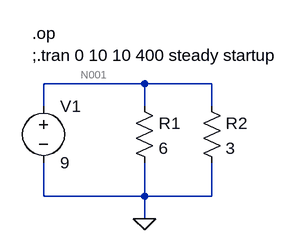
[diagram p0: schematic Draft5.asc]
Draft5.asc, the LTspice schematic file:
Version 4.1
SHEET 1 880 680
WIRE 192 16 48 16
WIRE 288 16 192 16
WIRE 48 48 48 16
WIRE 192 48 192 16
WIRE 288 48 288 16
WIRE 48 176 48 128
WIRE 192 176 192 128
WIRE 192 176 48 176
WIRE 288 176 288 128
WIRE 288 176 192 176
WIRE 192 208 192 176
FLAG 192 208 0
SYMBOL voltage 48 32 R0
SYMATTR InstName V1
SYMATTR Value 9
SYMBOL res 176 32 R0
SYMATTR InstName R1
SYMATTR Value 6
SYMBOL res 272 32 R0
SYMATTR InstName R2
SYMATTR Value 3
TEXT 32 -56 Left 2 !.op\n;.tran 0 10 10 400 steady startup

The netlist it stands for:
* Draft5.asc
V1 N001 0 9
R1 N001 0 6
R2 N001 0 3
.op
;.tran 0 10 10 400 steady startup
.backanno
.end

* Results of the author's LTspice run, read from the files saved beside the schematic
* Operating Point:
*   V(n001) = 9 V
*   I(R1) = 1.5 A
*   I(R2) = 3 A
*   I(V1) = -4.5 A